# EAGLE design lul (EAGLE 9.6.1)
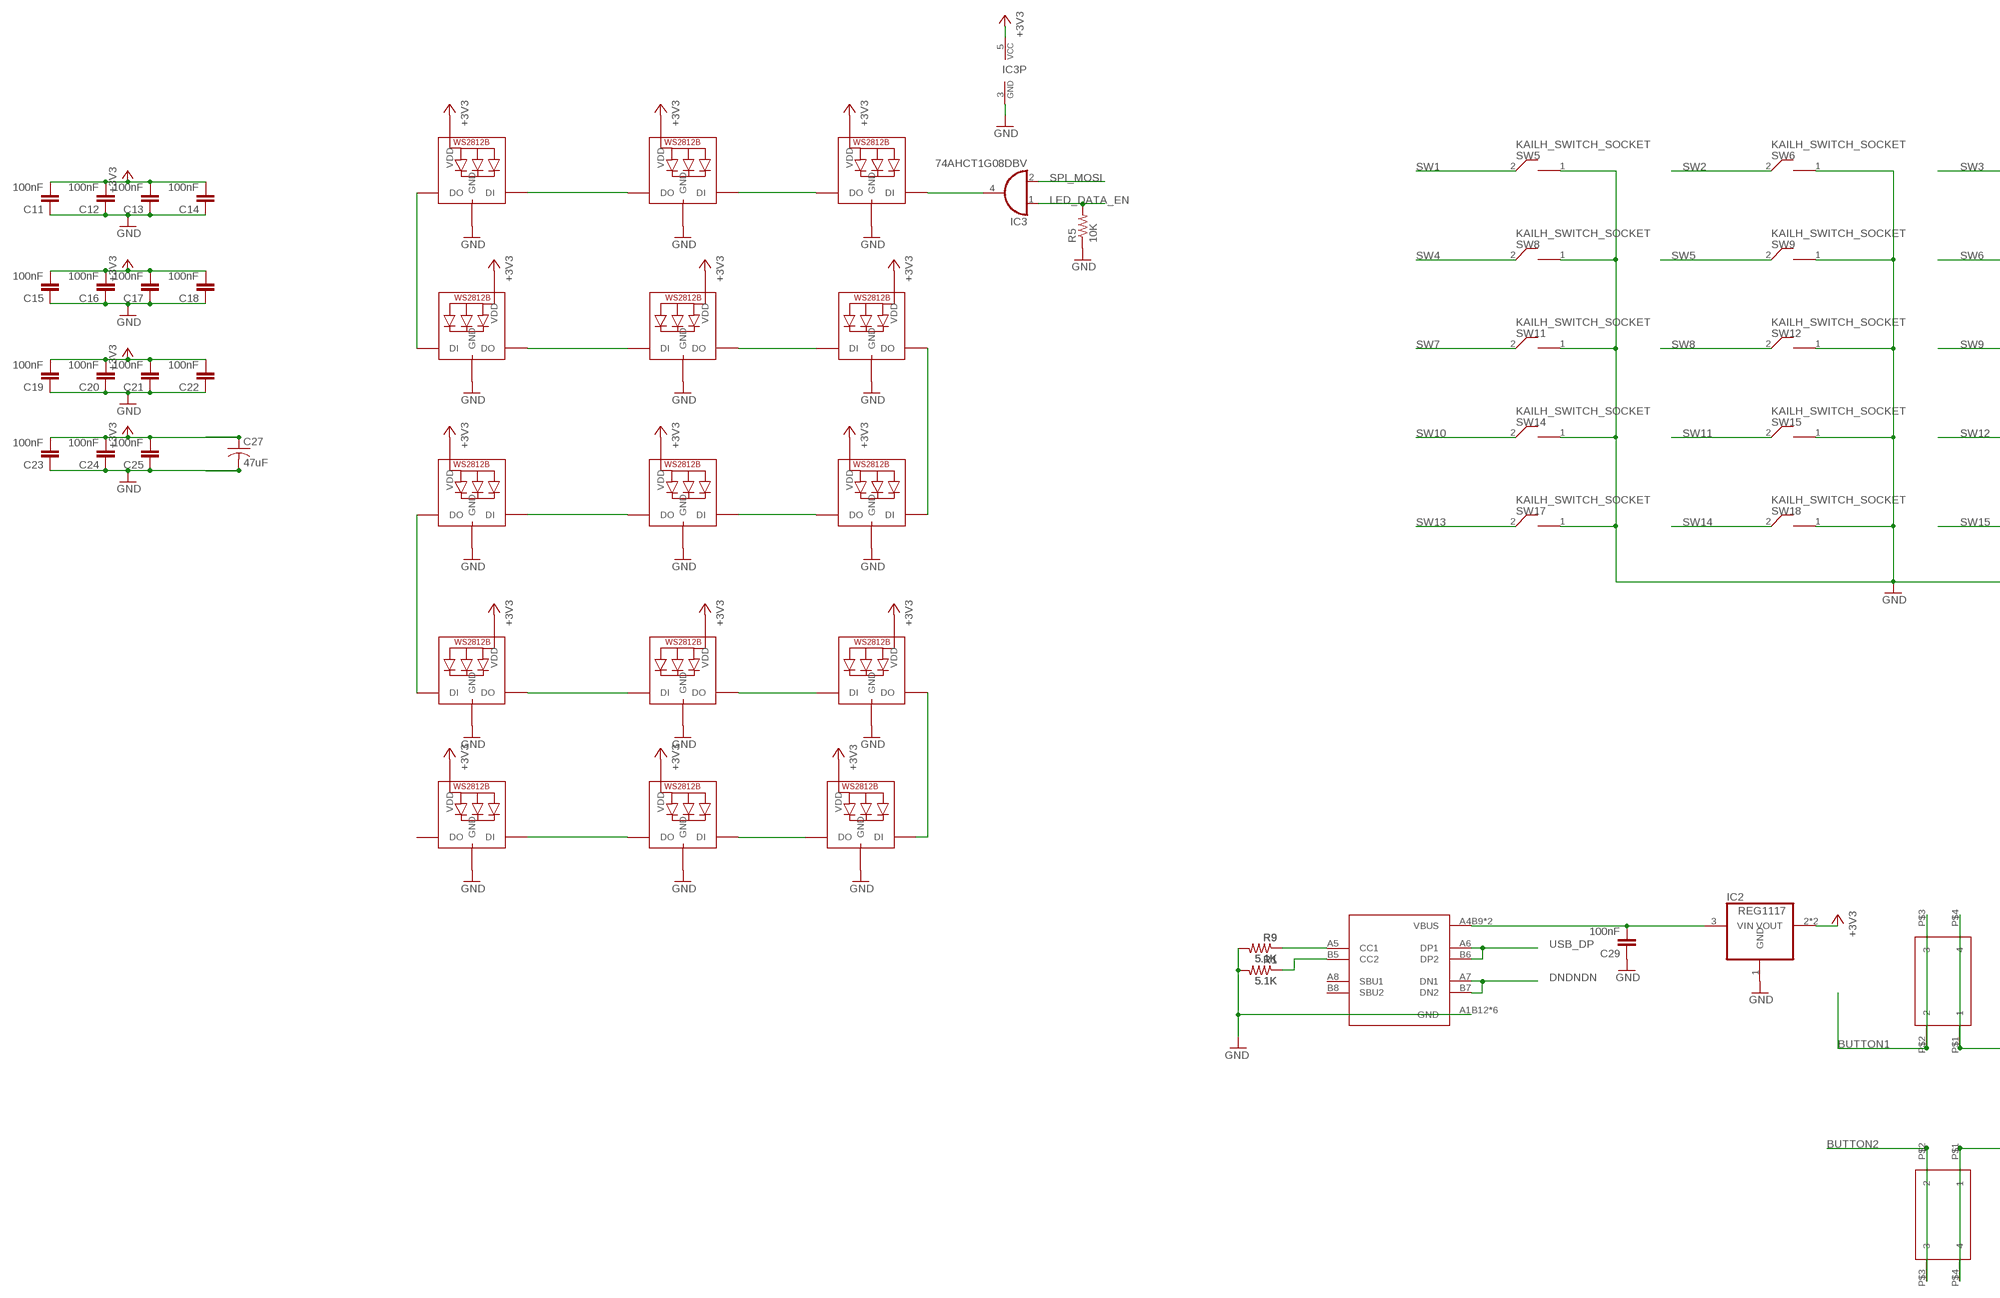
[diagram p0: schematic, sheet 1, part 1 of 2]
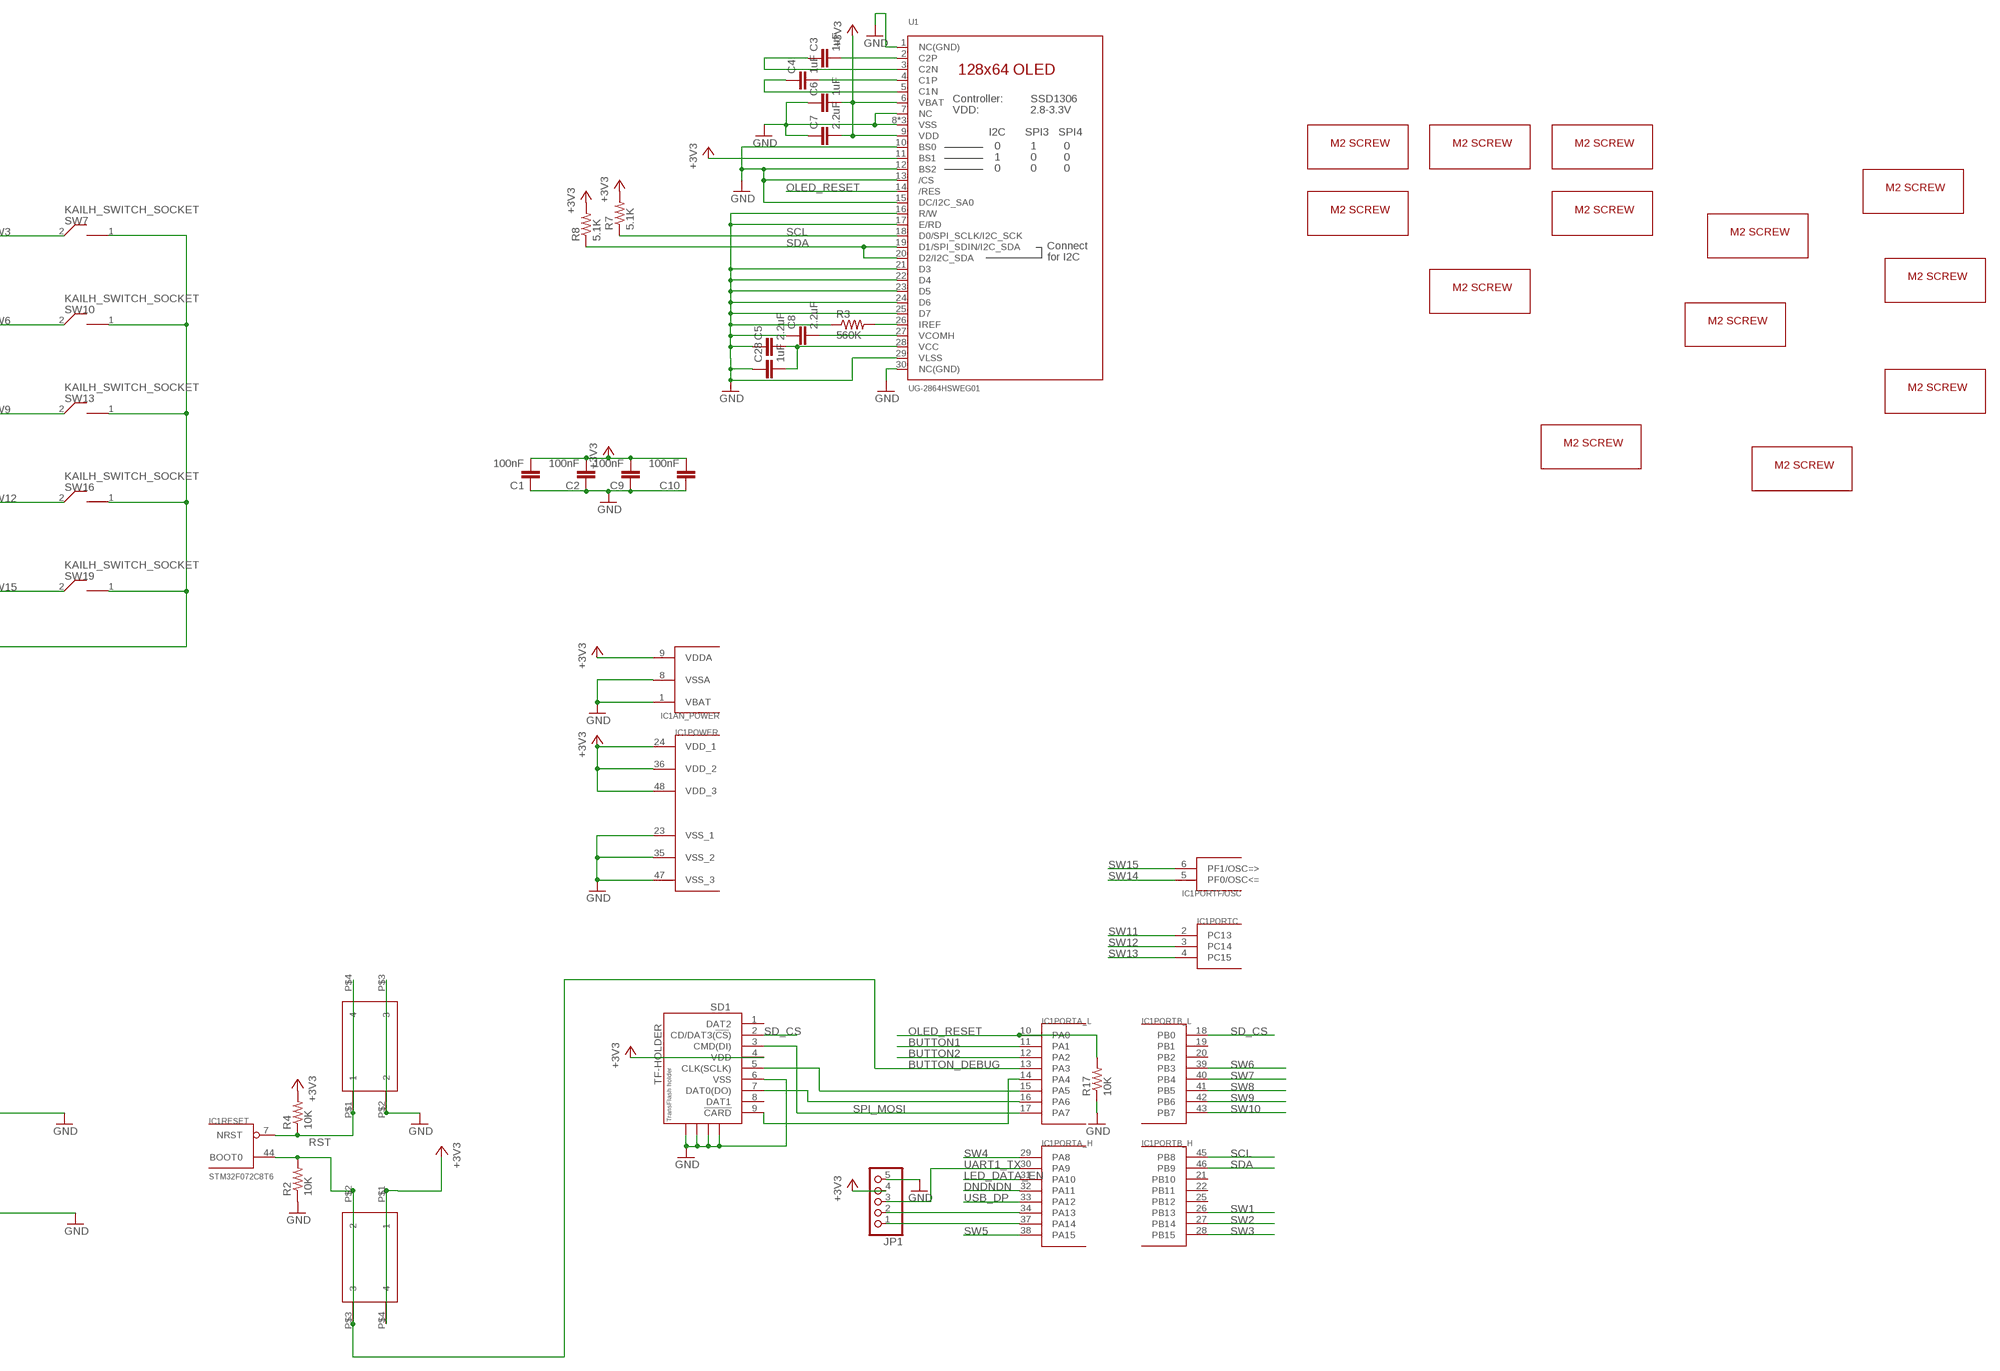
[diagram p1: schematic, sheet 1, part 2 of 2]

## Parts
C1  100nF  CAP0805  [0805@1]
C2  100nF  CAP0805  [0805@1]
C3  1uF  CAP0805  [0805@1]
C4  1uF  CAP0805  [0805@1]
C5  2.2uF  CAP0805  [0805@1]
C6  1uF  CAP0805  [0805@1]
C7  2.2uF  CAP0805  [0805@1]
C8  2.2uF  CAP0805  [0805@1]
C9  100nF  CAP0805  [0805@1]
C10  100nF  CAP0805  [0805@1]
C11  100nF  CAP0805  [0805@1]
C12  100nF  CAP0805  [0805@1]
C13  100nF  CAP0805  [0805@1]
C14  100nF  CAP0805  [0805@1]
C15  100nF  CAP0805  [0805@1]
C16  100nF  CAP0805  [0805@1]
C17  100nF  CAP0805  [0805@1]
C18  100nF  CAP0805  [0805@1]
C19  100nF  CAP0805  [0805@1]
C20  100nF  CAP0805  [0805@1]
C21  100nF  CAP0805  [0805@1]
C22  100nF  CAP0805  [0805@1]
C23  100nF  CAP0805  [0805@1]
C24  100nF  CAP0805  [0805@1]
C25  100nF  CAP0805  [0805@1]
C27  47uF  C-USC1210  [C1210]
C28  1uF  CAP0805  [0805@1]
C29  100nF  CAP0805  [0805@1]
IC1  STM32F072C8T6  [TQFP48]
IC2  REG1117  [SOT223]
IC3  74AHCT1G08DBV  [SOT23-5]
JP1  PINHD-1X5  [1X05]
LED1  WS2812B  [REVERSE_MNT]
LED2  WS2812B  [REVERSE_MNT]
LED3  WS2812B  [REVERSE_MNT]
LED4  WS2812B  [REVERSE_MNT]
LED5  WS2812B  [REVERSE_MNT]
LED6  WS2812B  [REVERSE_MNT]
LED7  WS2812B  [REVERSE_MNT]
LED8  WS2812B  [REVERSE_MNT]
LED9  WS2812B  [REVERSE_MNT]
LED10  WS2812B  [REVERSE_MNT]
LED11  WS2812B  [REVERSE_MNT]
LED12  WS2812B  [REVERSE_MNT]
LED13  WS2812B  [REVERSE_MNT]
LED14  WS2812B  [REVERSE_MNT]
LED15  WS2812B  [REVERSE_MNT]
R1  5.1K  RESISTOR0805-RES  [0805]
R2  10K  RESISTOR0805-RES  [0805]
R3  560K  RESISTOR0805-RES  [0805]
R4  10K  RESISTOR0805-RES  [0805]
R5  10K  RESISTOR0805-RES  [0805]
R7  5.1K  RESISTOR0805-RES  [0805]
R8  5.1K  RESISTOR0805-RES  [0805]
R9  5.1K  RESISTOR0805-RES  [0805]
R17  10K  RESISTOR0805-RES  [0805]
SD1  TF-HOLDER  [TF-PULL]
SW1  324_SW324_SWITCH_FOOT_HOLE  [342_SWICH_FOOT_HOLE]
SW2  324_SW324_SWITCH_FOOT_HOLE  [342_SWICH_FOOT_HOLE]
SW3  324_SW  [342_SWICH_FOOT]
SW4  324_SW  [342_SWICH_FOOT]
SW5  KAILH_SWITCH_SOCKET  [SWITCH_SOCKET]
SW6  KAILH_SWITCH_SOCKET  [SWITCH_SOCKET]
SW7  KAILH_SWITCH_SOCKET  [SWITCH_SOCKET]
SW8  KAILH_SWITCH_SOCKET  [SWITCH_SOCKET]
SW9  KAILH_SWITCH_SOCKET  [SWITCH_SOCKET]
SW10  KAILH_SWITCH_SOCKET  [SWITCH_SOCKET]
SW11  KAILH_SWITCH_SOCKET  [SWITCH_SOCKET]
SW12  KAILH_SWITCH_SOCKET  [SWITCH_SOCKET]
SW13  KAILH_SWITCH_SOCKET  [SWITCH_SOCKET]
SW14  KAILH_SWITCH_SOCKET  [SWITCH_SOCKET]
SW15  KAILH_SWITCH_SOCKET  [SWITCH_SOCKET]
SW16  KAILH_SWITCH_SOCKET  [SWITCH_SOCKET]
SW17  KAILH_SWITCH_SOCKET  [SWITCH_SOCKET]
SW18  KAILH_SWITCH_SOCKET  [SWITCH_SOCKET]
SW19  KAILH_SWITCH_SOCKET  [SWITCH_SOCKET]
U1  UG-2864HSWEG01  LUL_DISP_OLED_UG-2864HSWEG01  [LUL_UG-2864HSWEG01_1.3_WRAPAROUND]
U2  USBC_16P  [USBC_16P_FOOT]
U$7  M2_SCREW_DEV  [M2_SCREW_FOOT]
U$8  M2_SCREW_DEV  [M2_SCREW_FOOT]
U$9  M2_SCREW_DEV  [M2_SCREW_FOOT]
U$10  M2_SCREW_DEV  [M2_SCREW_FOOT]
U$11  M2_SCREW_DEV  [M2_SCREW_FOOT]
U$12  M2_SCREW_DEV  [M2_SCREW_FOOT]
U$13  M2_SCREW_DEV  [M2_SCREW_FOOT]
U$14  M2_SCREW_DEV  [M2_SCREW_FOOT]
U$15  M2_SCREW_DEV  [M2_SCREW_FOOT]
U$16  M2_SCREW_DEV  [M2_SCREW_FOOT]
U$17  M2_SCREW_DEV  [M2_SCREW_FOOT]
U$22  M2_SCREW_DEV  [M2_SCREW_FOOT]
U$23  M2_SCREW_DEV  [M2_SCREW_FOOT]

## Nets
+3V3: C1.2 C2.2 C6.2 C7.2 C9.2 C10.2 C11.2 C12.2 C13.2 C14.2 C15.2 C16.2 C17.2 C18.2 C19.2 C20.2 C21.2 C22.2 C23.2 C24.2 C25.2 C27.1 IC1.9(AN_POWER:VDDA) IC1.24(POWER:VDD_1) IC1.36(POWER:VDD_2) IC1.48(POWER:VDD_3) IC2.2(VOUT) IC2.4(VOUT) IC3.5(VCC) JP1.4 LED1.VDD LED2.VDD LED3.VDD LED4.VDD LED5.VDD LED6.VDD LED7.VDD LED8.VDD LED9.VDD LED10.VDD LED11.VDD LED12.VDD LED13.VDD LED14.VDD LED15.VDD R4.2 R7.2 R8.2 SD1.4(VDD) SW1.P$1 SW1.P$4 U1.6(VBAT) U1.9(VDD) U1.11(BS1)
BUTTON1: IC1.11(PORTA_L:PA1) SW3.P$2 SW3.P$3
BUTTON2: IC1.12(PORTA_L:PA2) SW4.P$2 SW4.P$3
BUTTON_DEBUG: IC1.13(PORTA_L:PA3) IC1.44(RESET:BOOT0) R2.2 SW1.P$2 SW1.P$3
DNDNDN: IC1.32(PORTA_H:PA11) U2.A7(DN1) U2.B7(DN2)
GND: C1.1 C2.1 C5.1 C6.1 C7.1 C8.1 C9.1 C10.1 C11.1 C12.1 C13.1 C14.1 C15.1 C16.1 C17.1 C18.1 C19.1 C20.1 C21.1 C22.1 C23.1 C24.1 C25.1 C27.2 C28.1 C29.1 IC1.1(AN_POWER:VBAT) IC1.8(AN_POWER:VSSA) IC1.23(POWER:VSS_1) IC1.35(POWER:VSS_2) IC1.47(POWER:VSS_3) IC2.1(GND) IC3.3(GND) JP1.5 LED1.GND LED2.GND LED3.GND LED4.GND LED5.GND LED6.GND LED7.GND LED8.GND LED9.GND LED10.GND LED11.GND LED12.GND LED13.GND LED14.GND LED15.GND R1.2 R2.1 R3.1 R5.1 R9.2 R17.1 SD1.6(VSS) SD1.S1 SD1.S2 SD1.S3 SD1.S4 SW2.P$2 SW2.P$3 SW3.P$1 SW3.P$4 SW4.P$1 SW4.P$4 SW5.1 SW6.1 SW7.1 SW8.1 SW9.1 SW10.1 SW11.1 SW12.1 SW13.1 SW14.1 SW15.1 SW16.1 SW17.1 SW18.1 SW19.1 U1.1(NC(GND)) U1.7(NC) U1.8(VSS) U1.10(BS0) U1.12(BS2) U1.13(/CS) U1.15(DC/I2C_SA0) U1.16(R/W) U1.17(E/RD) U1.21(D3) U1.22(D4) U1.23(D5) U1.24(D6) U1.25(D7) U1.29(VLSS) U1.30(NC(GND)) U1.31(VSS) U1.32(VSS) U2.A1B12(GND) U2.B11A12(GND) U2.P$13(GND) U2.P$14(GND) U2.P$15(GND) U2.P$16(GND)
LED_DATA_EN: IC1.31(PORTA_H:PA10) IC3.1(I0) R5.2
N$1: C29.2 IC2.3(VIN) U2.A4B9(VBUS) U2.B4A9(VBUS)
N$3: R3.2 U1.26(IREF)
N$4: C3.2 U1.2(C2P)
N$5: C3.1 U1.3(C2N)
N$6: C4.2 U1.4(C1P)
N$7: C4.1 U1.5(C1N)
N$8: IC1.15(PORTA_L:PA5) SD1.5(CLK(SCLK))
N$9: LED2.DIN(DI) LED3.DOUT(DO)
N$10: IC1.16(PORTA_L:PA6) SD1.7(DAT0(DO))
N$11: C5.2 C28.2 U1.28(VCC)
N$12: C8.2 U1.27(VCOMH)
N$14: IC1.14(PORTA_L:PA4) SD1.9(!CARD)
N$15: LED1.DIN(DI) LED2.DOUT(DO)
N$17: LED1.DOUT(DO) LED4.DIN(DI)
N$18: LED4.DOUT(DO) LED5.DIN(DI)
N$19: LED5.DOUT(DO) LED6.DIN(DI)
N$20: LED6.DOUT(DO) LED9.DIN(DI)
N$21: LED8.DIN(DI) LED9.DOUT(DO)
N$22: LED7.DIN(DI) LED8.DOUT(DO)
N$23: LED7.DOUT(DO) LED10.DIN(DI)
N$24: LED10.DOUT(DO) LED11.DIN(DI)
N$25: LED11.DOUT(DO) LED12.DIN(DI)
N$26: LED12.DOUT(DO) LED15.DIN(DI)
N$27: LED14.DIN(DI) LED15.DOUT(DO)
N$28: LED13.DIN(DI) LED14.DOUT(DO)
N$29: IC3.4(O) LED3.DIN(DI)
N$31: R1.1 U2.B5(CC2)
N$32: IC1.37(PORTA_H:PA14) JP1.1
N$33: R9.1 U2.A5(CC1)
N$34: IC1.34(PORTA_H:PA13) JP1.2
OLED_RESET: IC1.10(PORTA_L:PA0) R17.2 U1.14(/RES)
RST: IC1.7(RESET:NRST) R4.1 SW2.P$1 SW2.P$4
SCL: IC1.45(PORTB_H:PB8) R7.1 U1.18(D0/SPI_SCLK/I2C_SCK)
SD_CS: IC1.18(PORTB_L:PB0) SD1.2(CD/DAT3(!CS!))
SDA: IC1.46(PORTB_H:PB9) R8.1 U1.19(D1/SPI_SDIN/I2C_SDA) U1.20(D2/I2C_SDA)
SPI_MOSI: IC1.17(PORTA_L:PA7) IC3.2(I1) SD1.3(CMD(DI))
SW1: IC1.26(PORTB_H:PB13) SW5.2
SW2: IC1.27(PORTB_H:PB14) SW6.2
SW3: IC1.28(PORTB_H:PB15) SW7.2
SW4: IC1.29(PORTA_H:PA8) SW8.2
SW5: IC1.38(PORTA_H:PA15) SW9.2
SW6: IC1.39(PORTB_L:PB3) SW10.2
SW7: IC1.40(PORTB_L:PB4) SW11.2
SW8: IC1.41(PORTB_L:PB5) SW12.2
SW9: IC1.42(PORTB_L:PB6) SW13.2
SW10: IC1.43(PORTB_L:PB7) SW14.2
SW11: IC1.2(PORTC:PC13) SW15.2
SW12: IC1.3(PORTC:PC14) SW16.2
SW13: IC1.4(PORTC:PC15) SW17.2
SW14: IC1.5(PORTF/OSC:PF0/OSC<=) SW18.2
SW15: IC1.6(PORTF/OSC:PF1/OSC=>) SW19.2
UART1_TX: IC1.30(PORTA_H:PA9) JP1.3
USB_DP: IC1.33(PORTA_H:PA12) U2.A6(DP1) U2.B6(DP2)
Unconnected: IC1.19(PORTB_L:PB1) IC1.20(PORTB_L:PB2) IC1.21(PORTB_H:PB10) IC1.22(PORTB_H:PB11) IC1.25(PORTB_H:PB12) LED13.DOUT(DO) SD1.1(DAT2) SD1.8(DAT1) U2.A8(SBU1) U2.B8(SBU2)

## Library data of the parts
C1-C25 C28 C29 = clock:CAP: Capacitor Standard 0603 ceramic capacitor, and 0.1" leaded capacitor.
C27 = clock:C-US: CAPACITOR, American symbol
IC1 = clock:STM32F072C8T6: ST STM32F072 48pin LQFP
IC2 = clock:REG1117: 800mA and 1A Low Dropout (LDO) Positive Regulator 1.8V, 2.5V, 2.85V, 3.3V, 5V, and Adj; MPN: REG1117; OC_FARNELL: 1097566; OC_NEWARK: 14P6981
IC3 = 74xx-little-de:74*1G08: 2-input AND gate
JP1 = pinhead:PINHD-1X5: PIN HEADER
LED1-LED15 = lul:WS2812B
R1 R9 = joyAnalog:RESISTOR: Resistor Basic schematic elements and footprints for 0603, 1206, and PTH resistors.
R2-R5 R7 R8 R17 = clock:RESISTOR: Resistor Basic schematic elements and footprints for 0603, 1206, and PTH resistors.
SD1 = clock:TF-HOLDER: TF / Micro SD socket is PUSH-PUSH type, the card can be pushed into and auto locked and pushed out by simply press the card. Surface Mounting type.
SW1 SW2 = 3pos_slide_switch:324_SW
SW3 SW4 = 3pos_slide_switch_centered:324_SW
SW5-SW19 = Kailh_switch_socket:KAILH_SWITCH_SOCKET
U1 = lul:LUL_DISP_OLED_UG-2864HSWEG01: UG-2864HSWEG01 OLED display Both 1.3" and 0.96" models share the same FPC tab footprint, only the screen dimensions vary.
U2 = my_usbc_16p:USBC_16P
U$7-U$17 U$22 U$23 = 3pos_slide_switch_centered:M2_SCREW_DEV

## Board
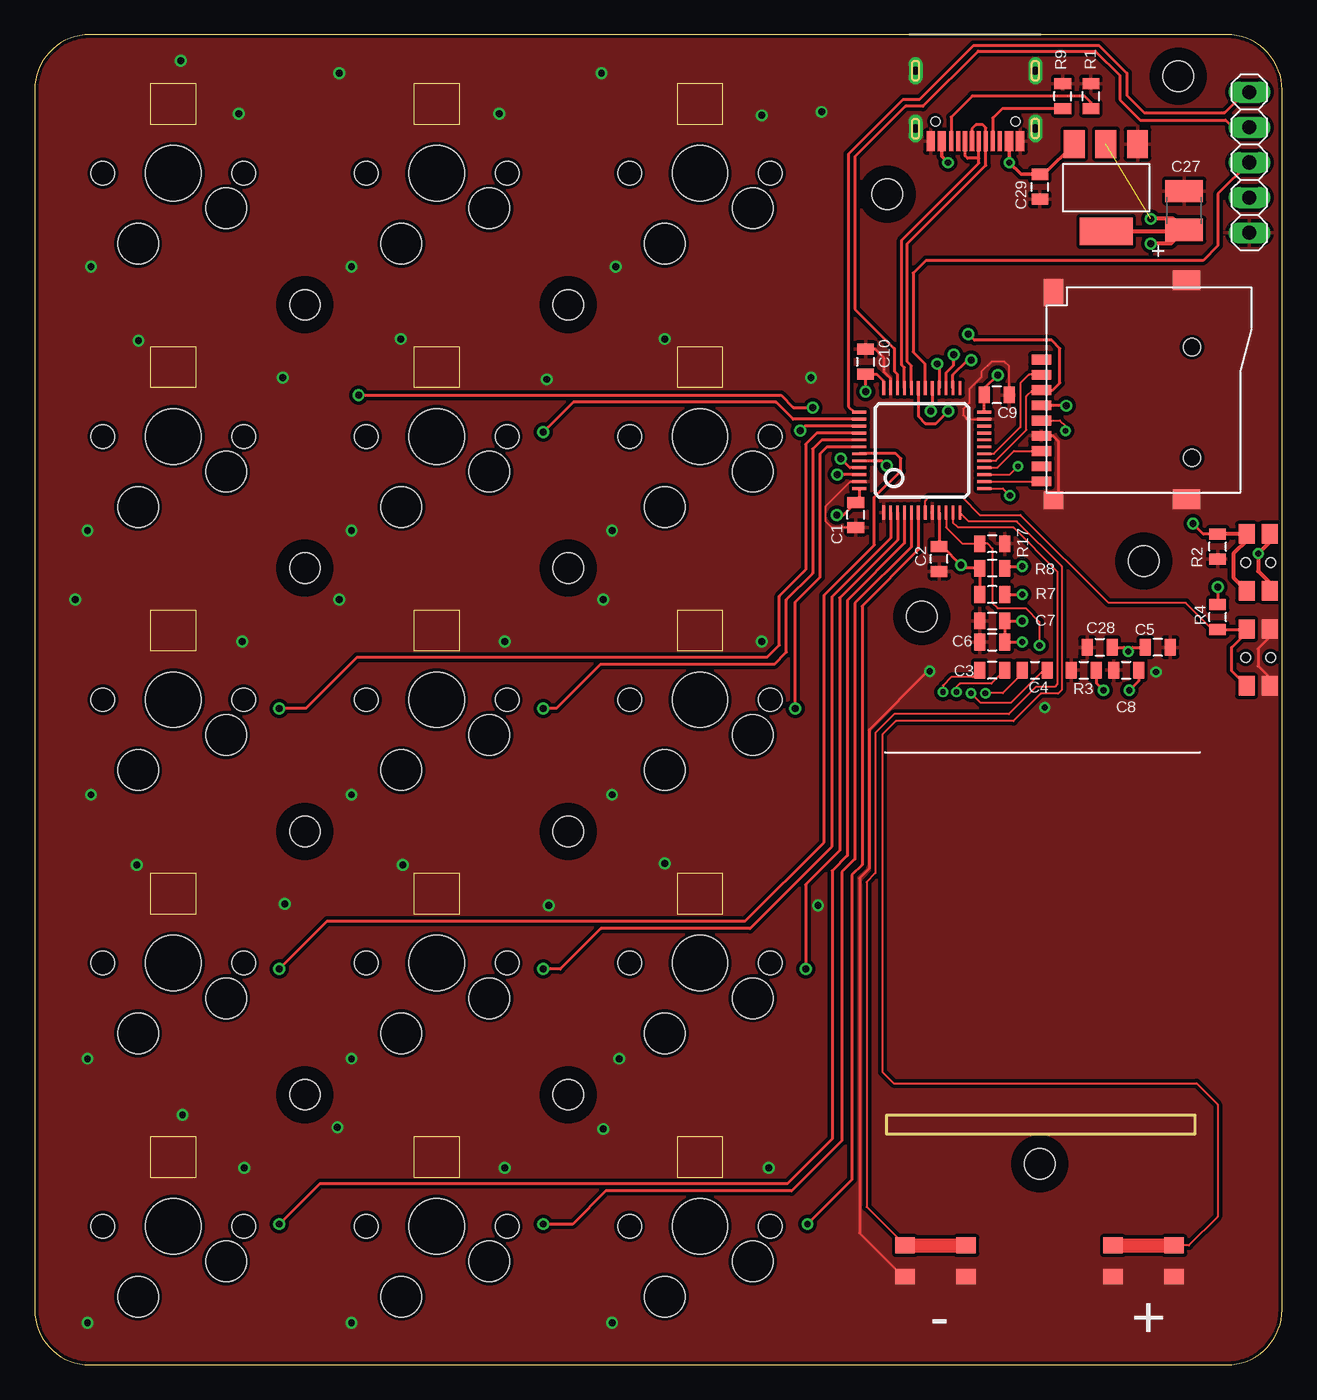
[diagram p2: board, top side]
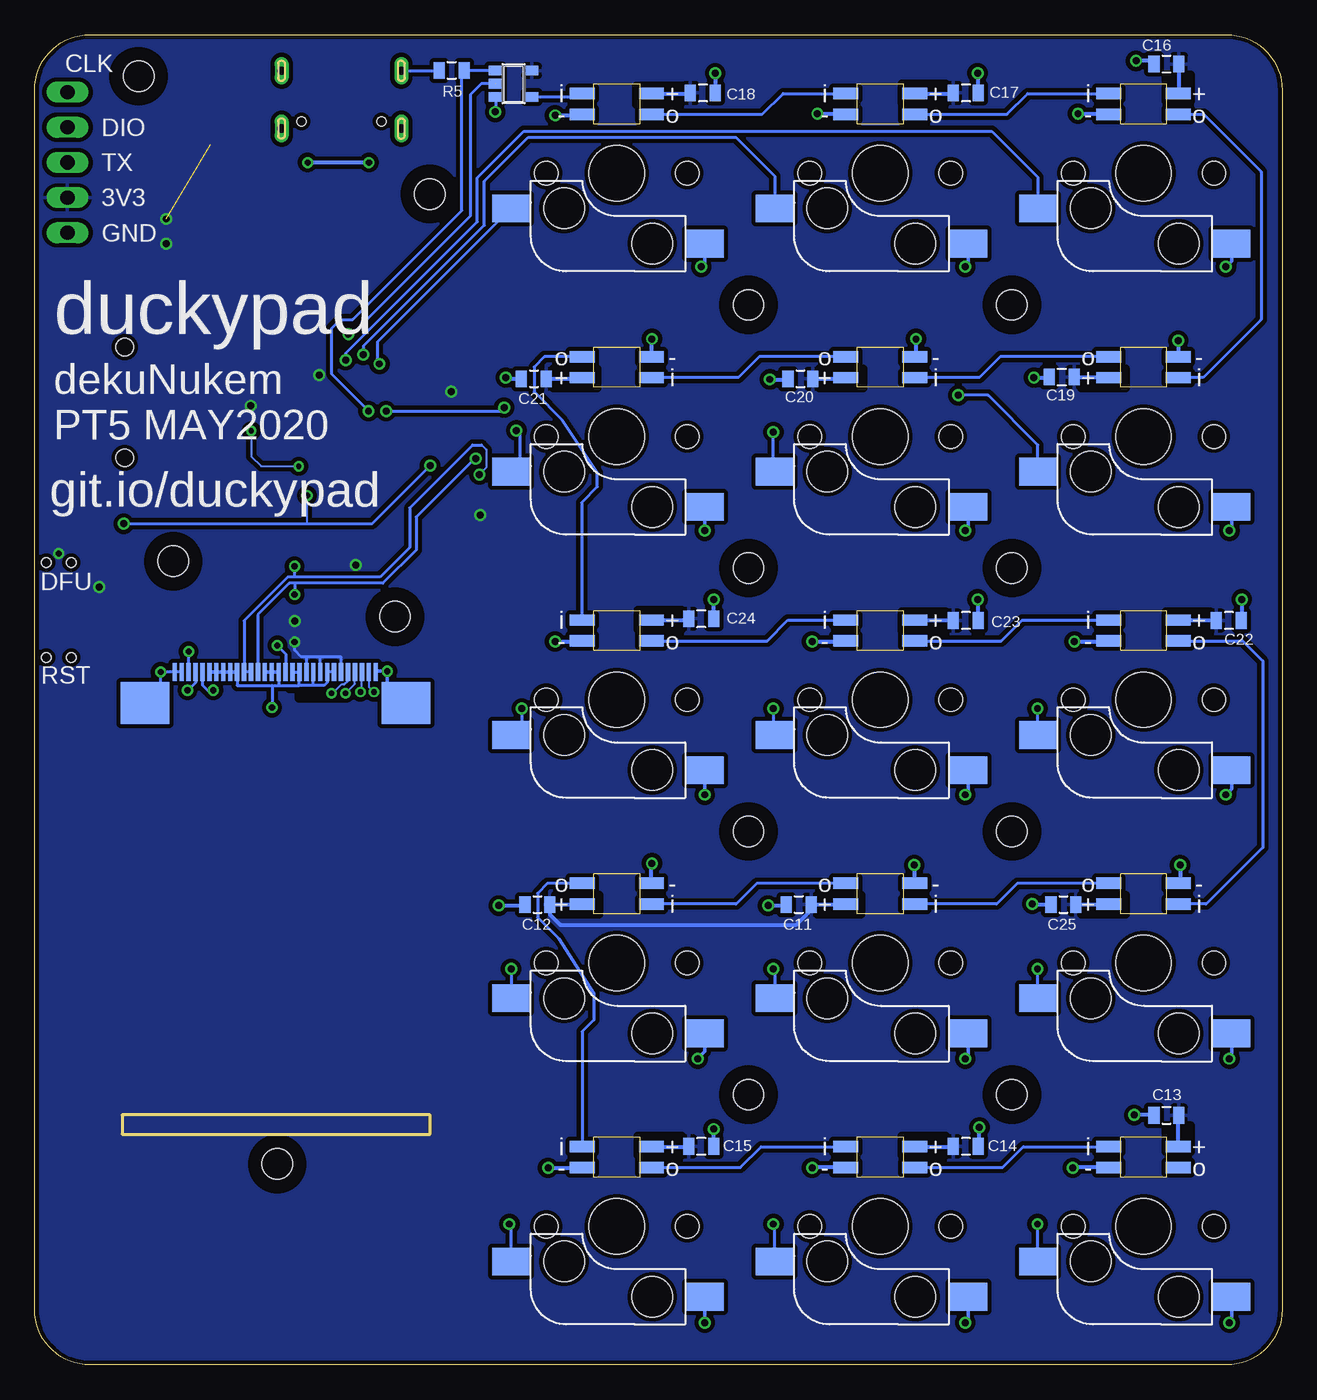
[diagram p3: board, bottom side, seen from below]

Size 90 x 96 mm. Coordinates in mm from the lower left corner, seen from the top.
Outline: 0,92 0,4 arc90 4,0 86,0 arc90 90,4 90,92 arc90 86,96 4,96 arc90 0,92
Copper layers (1*16): Top 0.035mm / dielectric 1.5mm / Bottom 0.035mm
Design rules "deku_2layer_6mil": minimum track width 6mil, minimum drill 15mil, track to track 6mil, track to pad 6mil, pad to pad 6mil, via to via 6mil, smd to smd 6mil, copper to edge 10mil, drill to drill 6mil, minimum pad ring 7mil, minimum via ring 7mil, stop-mask expansion 4mil, vias tented up to drill 25mil, thermal gap 10mil
tRestrict: area 36.7,74.7 to 40.3,78.3; area 80.7,91.2 to 84.3,94.8; area 59.7,82.7 to 63.3,86.3; area 78.2,56.2 to 81.8,59.8; area 62.2,52.2 to 65.8,55.8; area 17.7,74.7 to 21.3,78.3; area 17.7,55.7 to 21.3,59.3; area 36.7,55.7 to 40.3,59.3; area 36.7,36.7 to 40.3,40.3; area 17.7,17.7 to 21.3,21.3; area 36.7,17.7 to 40.3,21.3; area 17.7,36.7 to 21.3,40.3; 1 more areas
bRestrict: area 67.8,48.1 to 70.9,49.2; area 70.9,48.8 to 71.6,50.6; area 43.4,90.9 to 46.6,92.3; area 24.3,91.1 to 27.4,92.5; area 5.2,53 to 8.4,54.4; area 24.3,53 to 27.4,54.4; area 43.3,53.1 to 46.5,54.5; area 24.3,15.1 to 27.4,16.5; area 43.3,15.1 to 46.5,16.5; area 11.3,70.5 to 14.5,71.9; area 30.2,70.5 to 33.4,71.9; area 49.4,70.5 to 52.6,71.9; 18 more areas
Milling: area 61.5,16.6 to 83.7,18

### Footprints (pad centres in the part's own frame; a part is rotated, then mirrored left to right if it is on the bottom)
0805@1 = smd 0.8 x 1.2: 1 -0.9,0; 2 0.9,0
C1210 = smd 1.6 x 2.7: 1 -1.4,0; 2 1.4,0
TQFP48 = smd 0.2 x 1: 1 -2.75,-4.5; 2 -2.25,-4.5; 3 -1.75,-4.5; 4 -1.25,-4.5; 5 -0.75,-4.5; 6 -0.25,-4.5; 7 0.25,-4.5; 8 0.75,-4.5; 9 1.25,-4.5; 10 1.75,-4.5; 11 2.25,-4.5; 12 2.75,-4.5; 25 2.75,4.5; 26 2.25,4.5; 27 1.75,4.5; 28 1.25,4.5; 29 0.75,4.5; 30 0.25,4.5; 31 -0.25,4.5; 32 -0.75,4.5; 33 -1.25,4.5; 34 -1.75,4.5; 35 -2.25,4.5; 36 -2.75,4.5 | smd 1 x 0.2: 13 4.5,-2.75; 14 4.5,-2.25; 15 4.5,-1.75; 16 4.5,-1.25; 17 4.5,-0.75; 18 4.5,-0.25; 19 4.5,0.25; 20 4.5,0.75; 21 4.5,1.25; 22 4.5,1.75; 23 4.5,2.25; 24 4.5,2.75; 37 -4.5,2.75; 38 -4.5,2.25; 39 -4.5,1.75; 40 -4.5,1.25; 41 -4.5,0.75; 42 -4.5,0.25; 43 -4.5,-0.25; 44 -4.5,-0.75; 45 -4.5,-1.25; 46 -4.5,-1.75; 47 -4.5,-2.25; 48 -4.5,-2.75
SOT223 = smd 1.499 x 2.007: 1 -2.261,-3.15; 2 0.025,-3.15; 3 2.311,-3.15 | smd 3.81 x 2.007: 4 0,3.15
SOT23-5 = smd 0.69 x 0.99: 1 -0.95,-1.29; 2 0,-1.29; 3 0.95,-1.29; 4 0.95,1.3; 5 -0.95,1.3
1X05 = drill 1.016 long: 1 -5.08,0; 2 -2.54,0; 3 0,0; 4 2.54,0; 5 5.08,0
REVERSE_MNT = smd 1.8 x 0.82 bottom: DIN -2.5,-0.75; DOUT 2.5,0.75; GND -2.5,0.75; VDD 2.5,-0.75
0805 = smd 0.8 x 1.2: 1 -0.9,0; 2 0.9,0
TF-PULL = smd 0.7 x 1.4: 1 -2.2,-7.62; 2 -1.1,-7.62; 3 0,-7.62; 4 1.1,-7.62; 5 2.2,-7.62; 6 3.3,-7.62; 7 4.4,-7.62; 8 5.5,-7.62; 9 6.6,-7.62 | smd 1.4 x 2: S1 -7.9,2.85; S2 7.9,2.85 | smd 1.28 x 1.4: S3 7.96,-6.75 | smd 1.95 x 1.4: S4 -7.025,-6.75 | hole 1.25: -3.1,3.25; 4.9,3.25
342_SWICH_FOOT_HOLE = smd 1.4 x 1.15: P$1 -2.05,-0.825; P$2 -2.05,0.825; P$3 2.05,0.825; P$4 2.05,-0.825 | hole 0.7: 0,0.9; 0,-0.9
342_SWICH_FOOT = smd 1.4 x 1.15: P$1 -2.2,-1.125; P$2 -2.2,1.125; P$3 2.2,1.125; P$4 2.2,-1.125
SWITCH_SOCKET = smd 2.7 x 2 bottom: 1 6.355,5.08; 2 -7.625,2.54 | hole 4: 0,0 | hole 2.93: -3.81,2.54; 2.54,5.08 | hole 1.7: -5.08,0; 5.08,0
LUL_UG-2864HSWEG01_1.3_WRAPAROUND = smd 0.31 x 1.28 bottom: 1 -7.25,0; 2 -6.75,0; 3 -6.25,0; 4 -5.75,0; 5 -5.25,0; 6 -4.75,0; 7 -4.25,0; 8 -3.75,0; 9 -3.25,0; 10 -2.75,0; 11 -2.25,0; 12 -1.75,0; 13 -1.25,0; 14 -0.75,0; 15 -0.25,0; 16 0.25,0; 17 0.75,0; 18 1.25,0; 19 1.75,0; 20 2.25,0; 21 2.75,0; 22 3.25,0; 23 3.75,0; 24 4.25,0; 25 4.75,0; 26 5.25,0; 27 5.75,0; 28 6.25,0; 29 6.75,0; 30 7.25,0 | smd 3.5 x 3 bottom: 31 -9.45,-2.24; 32 9.4,-2.24
USBC_16P_FOOT = smd 0.6 x 1.45: A1B12 -3.225,3.848; A4B9 -2.425,3.848; B4A9 2.425,3.848; B11A12 3.225,3.848 | smd 0.3 x 1.45: A5 -1.25,3.848; A6 -0.25,3.848; A7 0.25,3.848; A8 1.25,3.848; B5 1.75,3.848; B6 0.75,3.848; B7 -0.75,3.848; B8 -1.75,3.848 | drill 0.6 pad 1 long: P$13 -4.32,2.933; P$14 4.32,2.933; P$15 -4.32,-1.248; P$16 4.32,-1.248 | hole 0.65: -2.89,2.402; 2.89,2.402
M2_SCREW_FOOT = hole 2.2: 0,0

### Placement (x,y rotation side)
C1  59.23,61.34 90 top
C2  65.25,58.17 90 top
C3  69.09,50.13 180 top
C4  72.16,50.13 0 top
C5  81.03,51.78 180 top
C6  69.09,52.16 0 top
C7  69.09,53.69 0 top
C8  78.74,50.13 0 top
C9  69.42,70 180 top
C10  59.94,72.39 270 top
C11  34.88,33.22 0 bottom
C12  53.73,33.22 0 bottom
C13  8.35,18.01 0 bottom
C14  22.82,15.77 180 bottom
C15  41.92,15.77 180 bottom
C16  8.35,93.88 0 bottom
C17  22.82,91.79 180 bottom
C18  41.79,91.79 180 bottom
C19  15.91,71.3 0 bottom
C20  34.75,71.17 0 bottom
C21  53.98,71.17 0 bottom
C22  3.84,53.72 180 bottom
C23  22.82,53.72 180 bottom
C24  41.92,53.85 180 bottom
C25  15.78,33.22 0 bottom
C27  82.93,83.31 90 top
C28  76.83,51.78 0 top
C29  72.52,85.01 90 top
IC1  64,66 0 top
IC2  77.31,84.95 180 top
IC3  55.45,92.46 270 bottom
JP1  87.63,86.77 270 top
LED1  10,91 180 top
LED2  29,91 180 top
LED3  48,91 180 top
LED4  10,72 0 top
LED5  29,72 0 top
LED6  48,72 0 top
LED7  10,53 180 top
LED8  29,53 180 top
LED9  48,53 180 top
LED10  10,34 0 top
LED11  29,34 0 top
LED12  48,34 0 top
LED13  10,15 180 top
LED14  29,15 180 top
LED15  48,15 180 top
R1  76.2,91.57 90 top
R2  85.34,59.05 90 top
R3  75.69,50.13 0 top
R4  85.34,53.98 90 top
R5  59.92,93.42 0 bottom
R7  69.09,55.59 180 top
R8  69.09,57.5 180 top
R9  74.17,91.57 90 top
R17  69.09,59.26 180 top
SD1  80.25,70.35 270 top
SW1  88.27,57.91 90 top
SW2  88.27,51.05 270 top
SW3  65,7.5 0 top
SW4  80,7.5 0 top
SW5  10,86 180 top
SW6  29,86 180 top
SW7  48,86 180 top
SW8  10,67 180 top
SW9  29,67 180 top
SW10  48,67 180 top
SW11  10,48 180 top
SW12  29,48 180 top
SW13  48,48 180 top
SW14  10,29 180 top
SW15  29,29 180 top
SW16  48,29 180 top
SW17  10,10 180 top
SW18  29,10 180 top
SW19  48,10 180 top
U1  72.64,50.01 0 top
U2  67.87,92.15 180 top
U$7  19.5,19.5 0 top
U$8  19.5,57.5 0 top
U$9  38.5,76.5 0 top
U$10  82.5,93 0 top
U$11  19.5,76.5 0 top
U$12  19.5,38.5 0 top
U$13  38.5,19.5 0 top
U$14  72.5,14.5 0 top
U$15  38.5,57.5 0 top
U$16  38.5,38.5 0 top
U$17  61.5,84.5 0 top
U$22  64,54 0 top
U$23  80,58 0 top

### Tracks (layer width: path | path; a pad name or v marks a point on that pad's centre or on a via)
+3V3  (via drill 0.45, 0.5)  (1 unrouted)
  Top 0.203: v59.94,70.23 C10.2 60.77,71.49 61.25,71.01 IC1.36 | SD1.4 74.38,69.25 v74.42,69.22 | v69.47,71.42 68.52,70.47 C9.2 68.5,69.98 IC1.24 | v57.86,61.34 58.33,61.34 C1.2 59.5,62.51 IC1.48 | IC1.9 C2.2 65.5,59.07 v66.83,57.73 67.06,57.5 R8.2 R7.2 | v71.25,53.69 C7.2 C6.2 v71.25,52.16 | 89.09,56.45 SW1.P$1 | v85.34,56.13 R4.2
  Top 0.305: IC2.4 82.82,81.81 | 82.82,81.81 C27.1 82.14,82.7 v80.52,82.7 | v80.52,80.92 81.94,80.92 82.82,81.81 | SW1.P$4 89.09,59.37 v88.27,58.55 88.27,57.28 89.09,56.45
  Bottom 0.203: U1.6 67.89,51.1 69.39,51.1 | 70.39,51.1 U1.11 | 69.39,51.1 70.39,51.1 | U1.9 69.39,51.1 | 70.39,51.1 70.76,51.1 71.25,51.58 v71.25,52.16 | 7.47,53.72 LED7.VDD | 45.48,15.77 LED15.VDD | 7.5,15.77 LED13.VDD | 7.45,91.8 LED1.VDD
  Bottom 0.254: 45.46,91.79 LED3.VDD
  Bottom 0.305: C16.2 7.45,91.8 | LED2.VDD 23.76,91.75 C17.2 | LED3.VDD 42.73,91.75 C18.2 | C19.2 12.55,71.3 LED4.VDD | C21.2 50.58,71.17 LED6.VDD | C20.2 31.58,71.17 LED5.VDD | C22.2 7.47,53.72 | LED9.VDD 42.91,53.75 C24.2 | LED8.VDD 23.75,53.75 C23.2 | C25.2 12.53,33.22 LED10.VDD | LED11.VDD 31.53,33.22 C11.2 33.98,32.82 35.05,31.75 52.07,31.75 52.83,32.51 C12.2 50.53,33.22 LED12.VDD | LED15.VDD 42.84,15.75 C15.2 | LED14.VDD 23.74,15.75 C14.2 | LED13.VDD 7.5,17.96 C13.2
  pour Bottom (isolate 0.305): 0,96.01 0,0 90.04,0 90.04,96.01
BUTTON1
  Top 0.152: IC1.11 66.25,60.8 66.6,60.45 70.59,60.45 73.79,57.25 73.79,49.12 73.58,48.92 72.24,48.92 70.28,46.97 62,46.97 60.66,45.62 60.66,35.48 60.02,34.85 60.02,11.4 SW3.P$2
  Top 1.016: SW3.P$2 SW3.P$3
BUTTON2
  Top 0.152: IC1.12 67.39,60.87 70.86,60.87 74.09,57.64 74.09,48.7 73.84,48.44 72.59,48.44 70.61,46.46 62.13,46.46 61.16,45.5 61.16,21.13 61.98,20.32 83.82,20.32 85.34,18.8 85.34,10.7 83.27,8.62 SW4.P$3
  Top 1.016: SW4.P$2 SW4.P$3
BUTTON_DEBUG  (via drill 0.45, 0.5)
  Top 0.152: IC1.13 69.85,63.25 v70.36,62.74
  Top 0.203: IC1.44 61.12,65.25 v61.47,64.9 | R2.2 84.32,59.95 v83.57,60.71
  Top 0.305: SW1.P$2 86.48,56.82 86.48,58.54 87.44,59.5 SW1.P$3 R2.2
  Bottom 0.152: v70.36,62.74 70.36,60.71
  Bottom 0.203: v61.47,64.9 65.66,60.71 70.36,60.71 v83.57,60.71
DNDNDN
  Top 0.203: IC1.32 63.25,72.11 62.94,72.42 62.94,80.9 68.62,86.58 U2.B7 68.62,89.27 68.4,89.48 67.89,89.48 67.62,89.21 U2.A7
GND  (via drill 0.45, 0.5)
  Top 0.152: IC1.23 67.26,68.25 66.98,68.53 66.98,68.99 67.44,69.44 67.44,70.43 68.3,71.3 68.3,71.68 69.04,72.42 69.95,72.42 70.31,72.06 70.31,70.01 C9.1 | C1.1 57.49,60.44 57.07,60.86 57.07,61.98 58.85,63.75 IC1.47 | 59.51,9.51 62.64,6.38 SW3.P$1
  Top 0.203: IC1.35 61.75,71.19 61.29,71.65 61.29,72.64 60.64,73.29 C10.1 | SD1.6 73.46,67.05 73.86,66.65 73.86,62.76 SD1.S3 | 59.51,9.51 59.51,35.13 60.2,35.81 60.2,45.81 64.44,50.06 v64.57,50.06 | SW2.P$2 89.09,52.51 88.27,51.69 88.27,50.42 89.09,49.59 SW2.P$3
  Bottom 0.203: U1.13 U1.12 70.89,49.04 | U1.7 U1.8 68.89,49.26 69.11,49.04 69.89,49.04 | 69.89,49.04 70.89,49.04 | U1.15 72.39,49.04 | 72.39,49.04 70.89,49.04 | U1.21 75.39,49.04 72.87,49.04 | 72.87,49.04 72.39,49.04 | 69.89,49.04 U1.10 | U1.29 U1.30 v80.9,50.01 80.9,48.91 U1.32 | 72.87,49.04 v72.87,47.44 | v56.77,90.42 56.74,90.45 IC3.3 | 21.97,53.77 C23.1 | C24.1 | U2.P$16 60.84,93.4 R5.1
  Bottom 0.254: U1.31 64.57,49.14 v64.57,50.06 65.34,50.06 U1.1 | U1.15 U1.16 U1.17 | U1.21 U1.22 U1.23 U1.24 U1.25 | v4.06,79.25 3.65,79.67 SW5.1 | v22.86,79.25 22.64,79.46 SW6.1 | v41.91,79.25 41.65,79.51 SW7.1 | v3.81,60.2 3.65,60.36 SW8.1 | v22.86,60.2 22.64,60.41 SW9.1 | v41.66,60.2 41.65,60.21 SW10.1 | v4.06,41.15 3.65,41.57 SW11.1 | v22.86,41.15 22.64,41.36 SW12.1 | v41.66,41.15 41.65,41.16 SW13.1 | v3.81,22.1 3.65,22.26 SW14.1 | v22.86,22.1 22.64,22.31 SW15.1 | v42.16,22.1 41.65,22.62 SW16.1 | v3.81,3.05 3.65,3.21 SW17.1 | v22.86,3.05 22.64,3.26 SW18.1 | v41.66,3.05 41.65,3.06 SW19.1
  Bottom 0.305: C16.1 9.47,94.11 v10.54,94.11 | v14.73,90.3 12.55,90.3 LED1.GND | v21.97,93.22 21.97,91.85 C17.1 | v33.53,90.3 31.55,90.3 LED2.GND | v40.89,93.22 C18.1 | v52.45,90.17 50.58,90.17 LED3.GND | v7.49,73.91 v7.5,73.91 LED4.GND | v17.91,71.25 16.86,71.25 C19.1 | LED6.GND 45.47,72.78 v45.47,74.04 | v56.01,71.25 55.93,71.17 C21.1 | v36.96,71.12 35.7,71.12 C20.1 | LED5.GND 26.42,72.83 v26.42,74.04 | v14.99,52.2 12.55,52.2 LED7.GND | v2.92,55.24 2.92,53.74 C22.1 | v52.45,52.2 50.55,52.2 LED9.GND | C24.1 v41.02,55.24 | v33.91,52.2 31.55,52.2 LED8.GND | C23.1 21.92,55.19 v21.97,55.24 | v7.37,36.07 7.37,34.88 LED10.GND | v18.03,33.27 17.98,33.22 C25.1 | v37.08,33.15 35.86,33.15 C11.1 | LED11.GND 26.5,36.02 v26.54,36.07 | v56.52,33.15 54.7,33.15 C12.1 | LED12.GND 45.5,36.16 v45.47,36.2 | v52.96,14.22 50.53,14.22 LED15.GND | C15.1 v41.02,17.01 v41.02,17.02 | LED14.GND 33.88,14.25 v33.91,14.22 | C14.1 21.84,15.85 v21.84,17.14 | LED13.GND 15.09,14.25 v15.11,14.22 | C13.1 9.28,18.03 v10.67,18.03
  pour Top (isolate 0.254): 0,96 0,0 90,0 90,96
LED_DATA_EN  (via drill 0.5)
  Top 0.203: IC1.31 63.75,68.46 64.26,67.94 65.02,67.94 v65.91,68.83
  Bottom 0.203: v65.91,68.83 68.58,71.5 68.58,74.8 67.94,75.44 67.06,75.44 59.18,83.31 59.18,93.34 59.11,93.42 R5.2 59,93.41 IC3.1
N$1  (via drill 0.45)
  Top 0.254: U2.B4A9 65.44,87.21 v65.89,86.77 | U2.A4B9 70.29,86.81 v70.32,86.78 | v70.31,86.77 71.16,85.91 C29.2 72.8,85.91 IC2.3
  Top 0.305: v70.32,86.78 v70.31,86.77
  Bottom 0.305: v65.89,86.77 v70.31,86.77
N$3  (via drill 0.45)
  Top 0.203: R3.2 76.59,49.21 v77.11,48.69
  Bottom 0.203: U1.26 77.89,49.06 77.52,48.69 v77.11,48.69
N$4  (via drill 0.4)
  Top 0.152: v65.53,48.56 65.53,49.04 66.12,49.62 67.68,49.62 C3.2
  Bottom 0.152: v65.53,48.56 65.89,48.92 U1.2
N$5  (via drill 0.4)
  Top 0.152: v66.5,48.56 66.5,48.91 66.75,49.17 69.02,49.17 C3.1
  Bottom 0.152: v66.5,48.56 66.39,48.66 U1.3
N$6  (via drill 0.4)
  Top 0.152: v67.56,48.48 67.56,48.46 68.25,47.77 70.42,47.77 72.78,50.13 C4.2
  Bottom 0.152: v67.56,48.48 66.89,49.15 U1.4
N$7  (via drill 0.4)
  Top 0.152: C4.1 71.26,49.89 69.85,48.48 v68.58,48.48
  Bottom 0.152: U1.5 67.39,49.36 67.67,49.09 67.89,49.09 68.5,48.48 v68.58,48.48
N$8  (via drill 0.38)
  Top 0.152: IC1.15 70.35,64.25 v70.94,64.85 | SD1.5 73.96,68.15 74.37,67.74 v74.37,67.41
  Bottom 0.152: v74.37,67.41 74.37,65.56 73.66,64.85 v70.94,64.85
N$9
  Bottom 0.203: LED3.DOUT 37.51,90.25 36.01,91.75 LED2.DIN
N$10
  Top 0.152: IC1.16 69.45,64.75 70.65,65.95 SD1.7
N$11  (via drill 0.45)
  Top 0.203: C5.2 79.2,51.78 v78.89,51.48 78.59,51.78 C28.2
  Bottom 0.203: U1.28 v78.89,51.48
N$12  (via drill 0.45)
  Top 0.203: C8.2 79.64,49.36 v78.97,48.69
  Bottom 0.203: U1.27 78.39,49.26 v78.97,48.69
N$14
  Top 0.152: IC1.14 SD1.9
  Top 0.203: SD1.9
N$15
  Bottom 0.203: LED2.DOUT 19.86,90.25 18.36,91.75 LED1.DIN
N$17
  Bottom 0.203: LED1.DOUT 5.67,90.25 1.52,86.11 1.52,75.44 5.71,71.25 LED4.DIN
N$18
  Bottom 0.203: LED4.DOUT 20.34,72.75 21.84,71.25 LED5.DIN
N$19
  Bottom 0.203: LED5.DOUT 37.74,72.75 39.24,71.25 LED6.DIN
N$20
  Bottom 0.203: LED9.DIN 50.55,53.8 50.55,62.23 49.4,63.37 49.4,64.39 51.94,68.2 53.98,70.23 53.98,72.01 53.23,72.75 LED6.DOUT
N$21
  Bottom 0.203: LED9.DOUT 37.16,52.25 35.66,53.75 LED8.DIN
N$22
  Bottom 0.203: LED8.DOUT 20.27,52.25 18.77,53.75 LED7.DIN
N$23
  Bottom 0.203: LED7.DOUT 2.85,52.25 1.4,50.8 1.4,37.34 5.49,33.25 LED10.DIN
N$24
  Bottom 0.203: LED10.DOUT 19.1,34.75 20.6,33.25 LED11.DIN
N$25
  Bottom 0.203: LED11.DOUT 37.89,34.75 39.39,33.25 LED12.DIN
N$26
  Bottom 0.203: LED15.DIN 50.5,24.05 49.66,24.89 49.66,26.82 52.2,30.77 53.72,32.29 53.72,34.04 53.01,34.75 LED12.DOUT
N$27
  Bottom 0.203: LED15.DOUT 39.09,14.25 37.59,15.75 LED14.DIN
N$28
  Bottom 0.203: LED14.DOUT 20.17,14.25 18.67,15.75 LED13.DIN
N$29
  Bottom 0.203: IC3.4 50.74,91.51 LED3.DIN
N$31
  Top 0.203: R1.1 76.2,91.11 75.74,91.57 67.64,91.57 66.12,90.05 U2.B5
N$32
  Top 0.203: IC1.37 59.11,68.75 58.7,69.16 58.7,87.38 62.64,91.31 63.83,91.31 67.74,95.22 76.78,95.22 78.79,93.22 78.79,91.62 80.03,90.37 85.85,90.37 87.33,91.85 JP1.1
N$33
  Top 0.203: R9.1 69.81,90.67 69.12,89.97 U2.A5
N$34
  Top 0.203: IC1.34 62.25,71.48 62.03,71.7 62.03,73.36 59.18,76.2 59.18,87.2 62.81,90.83 64.08,90.83 68.07,94.82 76.53,94.82 78.28,93.07 78.28,91.31 79.76,89.84 85.91,89.84 86.44,89.31 JP1.2
OLED_RESET  (via drill 0.45)
  Top 0.152: IC1.10 65.75,60.44 66.93,59.26 R17.2 68.76,59.26 69.09,58.93 69.09,54.99 69.47,54.61 71.5,54.61 72.49,53.62 v72.49,51.91
  Bottom 0.203: v72.49,51.91 71.89,51.31 U1.14
RST
  Top 0.152: IC1.7 64.25,62.34 64.52,62.61 66.93,62.61 68.2,61.34 71.12,61.34 77.48,54.98 83.06,54.98 84.96,53.08 R4.1
  Top 0.203: SW2.P$4 86.36,50.08 86.36,51.77 87.44,52.85 SW2.P$1 87.41,53.08 R4.1
SCL  (via drill 0.45, 0.5)
  Top 0.203: R7.1 v71.25,55.59 | IC1.45 58.82,64.75 v58.17,65.41
  Bottom 0.203: 71.25,56.41 64.87,56.41 62.48,58.79 62.48,61.19 58.27,65.41 v58.17,65.41 | 71.25,56.41 71.63,56.41 73.89,54.14 U1.18 | 71.25,56.41 v71.25,55.59
SD_CS
  Top 0.152: IC1.18 69.2,65.75 71.12,67.67 71.12,70.84 71.73,71.45 SD1.2
SDA  (via drill 0.45, 0.5)
  Top 0.203: R8.1 70.11,57.63 v71.25,57.63 | IC1.46 57.92,64.25 v57.91,64.26
  Bottom 0.152: 57.4,66.04 57.4,64.77 v57.91,64.26
  Bottom 0.178: 57.76,66.4 57.4,66.04
  Bottom 0.203: 71.27,56.86 65.08,56.86 62.94,59 62.94,61.85 58.4,66.4 57.76,66.4 | 71.27,56.86 71.73,56.86 74.89,53.7 U1.20 U1.19 | 71.27,56.86 71.25,56.89 v71.25,57.63
SPI_MOSI  (via drill 0.5)
  Top 0.152: IC1.17 69.34,65.25 71.55,67.46 71.55,69.9 72,70.35 SD1.3
  Top 0.203: SD1.3 73.45,70.35 73.97,70.87 73.97,73.36 73.38,73.94 67.82,73.94 v67.36,74.4
  Bottom 0.203: IC3.2 57.78,92.46 58.55,91.69 58.55,82.93 67.08,74.4 v67.36,74.4
SW1  (via drill 0.5)
  Top 0.203: IC1.26 66.25,71.46 67.31,72.52 v67.56,72.52
  Bottom 0.203: v67.56,72.52 67.56,73 58.06,82.5 58.06,85.67 54.71,89.03 20.95,89.03 17.62,85.7 SW5.2
SW2  (via drill 0.5)
  Top 0.203: IC1.27 65.75,71.59 66.29,72.14 v66.29,72.9
  Bottom 0.203: v66.29,72.9 66.29,73.51 57.56,82.25 57.56,85.42 54.38,88.59 39.42,88.59 36.62,85.8 SW6.2
SW3  (via drill 0.5)
  Top 0.203: v65.13,72.24 65.25,72.11 IC1.28
  Bottom 0.203: v65.13,72.24 65.28,72.39 65.28,73.81 65.27,73.81 SW7.2
SW4  (via drill 0.5)
  Top 0.203: IC1.29 64.75,68.94 v64.64,68.83 | v56.13,69.09 54.74,69.09 53.85,69.98 v23.37,69.98
  Bottom 0.203: SW8.2 17.62,66.39 21.21,69.98 v23.37,69.98 | v56.13,69.09 56.39,68.83 v64.64,68.83
SW5  (via drill 0.5)
  Top 0.203: IC1.38 54.71,68.25 53.49,69.47 38.86,69.47 v36.7,67.31
  Bottom 0.203: SW9.2 36.7,64.54 v36.7,67.31
SW6  (via drill 0.5)
  Top 0.203: IC1.39 55.56,67.75 v55.24,67.44
  Bottom 0.203: v55.24,67.44 54.99,67.18 54.99,65.09 SW10.2
SW7  (via drill 0.5)
  Top 0.203: IC1.40 56.43,67.25 55.63,66.45 55.63,57.38 53.72,55.47 53.72,51.94 52.83,51.05 23.24,51.05 19.56,47.37 v17.65,47.37
  Bottom 0.203: v17.65,47.37 17.65,45.49 SW11.2
SW8  (via drill 0.5)
  Top 0.203: IC1.41 56.79,66.75 56.13,66.09 56.13,57.12 54.23,55.22 54.23,51.44 53.34,50.55 40.82,50.55 37.64,47.37 v36.7,47.37
  Bottom 0.203: v36.7,47.37 36.7,45.54 SW12.2
SW9  (via drill 0.5)
  Top 0.203: IC1.42 57.16,66.25 56.64,65.73 56.64,56.82 54.84,55.02 54.84,47.4 v54.86,47.37
  Bottom 0.203: v54.86,47.37 54.86,46.22 SW13.2
SW10  (via drill 0.5)
  Top 0.203: IC1.43 62.14,65.75 62.48,65.41 62.48,64.52 60.58,62.61 60.58,59.18 56.95,55.55 56.95,37.72 51.23,32 21.08,32 v17.65,28.57
  Bottom 0.203: v17.65,28.57 17.65,26.49 SW14.2
SW11  (via drill 0.5)
  Top 0.203: IC1.2 61.75,59.67 57.53,55.45 57.53,37.41 51.61,31.5 40.84,31.5 37.92,28.57 v36.7,28.57
  Bottom 0.203: v36.7,28.57 36.62,28.5 SW15.2
SW12  (via drill 0.5)
  Top 0.203: IC1.3 62.25,59.53 58.06,55.35 58.06,37.11 55.63,34.67 v55.63,28.57
  Bottom 0.203: v55.63,28.57 SW16.2
SW13  (via drill 0.5)
  Top 0.203: IC1.4 62.75,59.3 58.62,55.17 58.62,36.75 57.53,35.66 57.53,16.31 54.3,13.08 20.57,13.08 v17.65,10.16
  Bottom 0.203: v17.65,10.16 17.65,7.49 SW17.2
SW14  (via drill 0.5)
  Top 0.203: IC1.5 63.25,59.03 59.18,54.97 59.18,36.5 58.24,35.56 58.24,16.18 54.61,12.55 41.2,12.55 38.81,10.16 v36.7,10.16
  Bottom 0.203: SW18.2 36.62,10.08 v36.7,10.16
SW15  (via drill 0.5)
  Top 0.203: IC1.6 63.75,58.82 59.69,54.76 59.69,36.09 58.95,35.36 58.95,13.36 v55.75,10.16
  Bottom 0.203: SW19.2 55.62,10.03 v55.75,10.16
UART1_TX
  Top 0.203: IC1.30 64.25,72.22 63.37,73.1 63.37,78.79 64.29,79.7 84.3,79.7 85.37,80.77 85.37,84.51 JP1.3
USB_DP
  Top 0.203: IC1.33 62.75,71.97 62.56,72.16 62.56,81.18 68.12,86.74 68.12,87.07 | 68.12,87.07 U2.A6 | U2.B6 67.12,87.26 67.31,87.07 68.12,87.07

### Text on the board
tNames: - | +
bNames: CLK | DIO | TX | 3V3 | GND | duckypad | dekuNukem / PT5 MAY2020 | git.io/duckypad | DFU | RST